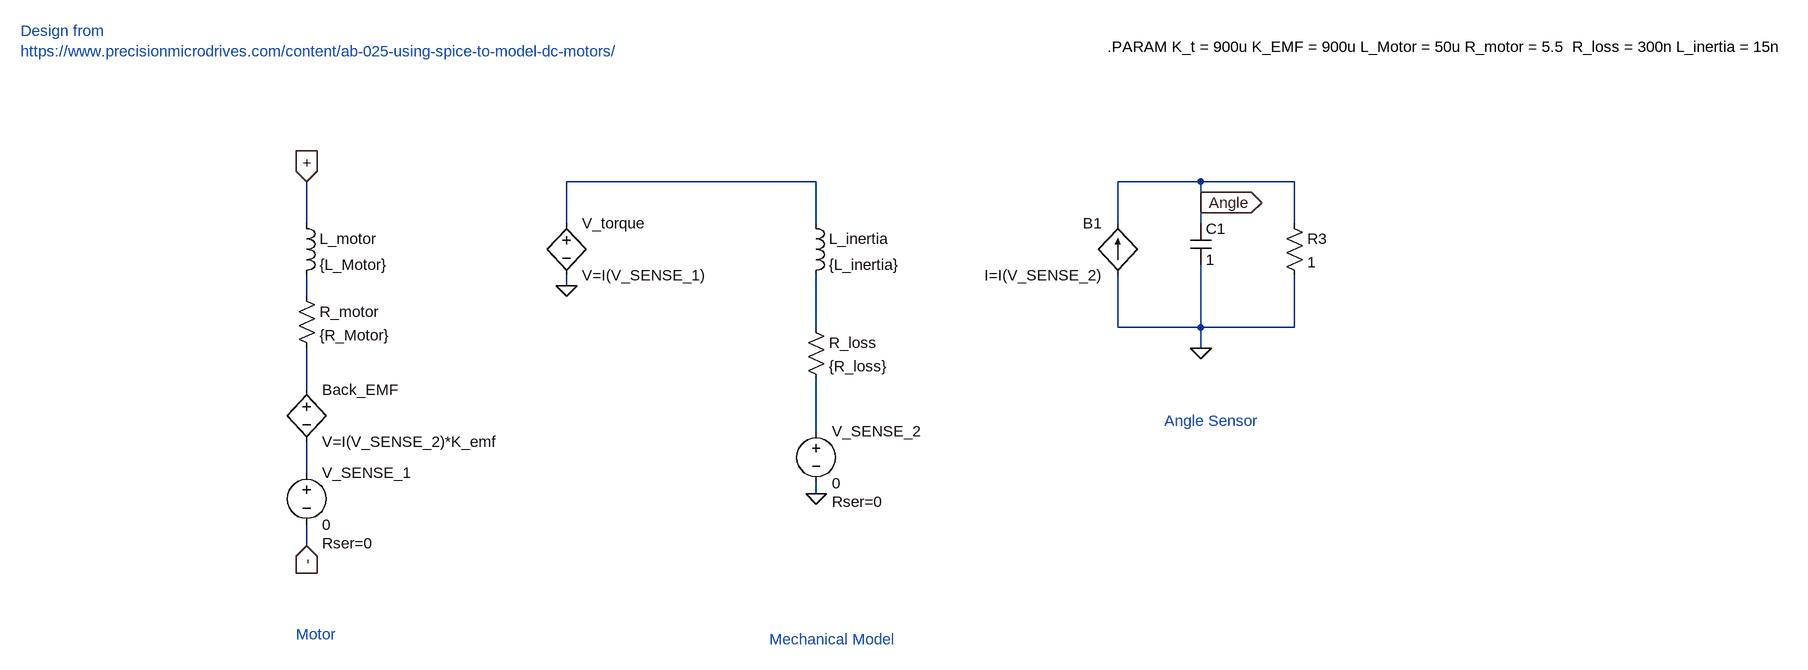
[diagram p0: schematic Servo.asc]
Servo.asc, the LTspice schematic file:
Version 4
SHEET 1 2604 808
WIRE 1024 64 640 64
WIRE 1616 64 1488 64
WIRE 1760 64 1616 64
WIRE 1616 96 1616 64
WIRE 240 128 240 64
WIRE 640 128 640 64
WIRE 1024 128 1024 64
WIRE 1488 128 1488 64
WIRE 1616 128 1616 96
WIRE 1760 128 1760 64
WIRE 640 224 640 208
WIRE 240 240 240 208
WIRE 1024 288 1024 208
WIRE 1488 288 1488 208
WIRE 1616 288 1616 192
WIRE 1616 288 1488 288
WIRE 1760 288 1760 208
WIRE 1760 288 1616 288
WIRE 1616 320 1616 288
WIRE 240 384 240 320
WIRE 1024 448 1024 368
WIRE 240 512 240 464
WIRE 1024 544 1024 528
WIRE 240 624 240 592
FLAG 640 224 0
FLAG 1024 544 0
FLAG 1616 320 0
FLAG 240 64 +
IOPIN 240 64 In
FLAG 1616 96 Angle
IOPIN 1616 96 Out
FLAG 240 624 -
IOPIN 240 624 In
SYMBOL voltage 240 496 R0
WINDOW 123 0 0 Left 0
WINDOW 39 24 124 Left 2
SYMATTR SpiceLine Rser=0
SYMATTR InstName V_SENSE_1
SYMATTR Value 0
SYMBOL voltage 1024 432 R0
WINDOW 123 0 0 Left 0
WINDOW 39 24 124 Left 2
SYMATTR SpiceLine Rser=0
SYMATTR InstName V_SENSE_2
SYMATTR Value 0
SYMBOL ind 224 112 R0
SYMATTR InstName L_motor
SYMATTR Value {L_Motor}
SYMBOL res 224 224 R0
SYMATTR InstName R_motor
SYMATTR Value {R_Motor}
SYMBOL ind 1008 112 R0
SYMATTR InstName L_inertia
SYMATTR Value {L_inertia}
SYMATTR SpiceLine Rser=0 Rpar=0
SYMBOL res 1008 272 R0
SYMATTR InstName R_loss
SYMATTR Value {R_loss}
SYMBOL cap 1600 128 R0
SYMATTR InstName C1
SYMATTR Value 1
SYMBOL res 1744 112 R0
SYMATTR InstName R3
SYMATTR Value 1
SYMBOL bv 640 112 R0
SYMATTR InstName V_torque
SYMATTR Value V=I(V_SENSE_1)
SYMBOL bv 240 368 R0
SYMATTR InstName Back_EMF
SYMATTR Value V=I(V_SENSE_2)*K_emf
SYMBOL bi 1488 208 R180
WINDOW 0 24 80 Left 2
WINDOW 3 24 0 Left 2
SYMATTR InstName B1
SYMATTR Value I=I(V_SENSE_2)
TEXT -200 -168 Left 2 ;Design from\nhttps://www.precisionmicrodrives.com/content/ab-025-using-spice-to-model-dc-motors/
TEXT 1472 -144 Left 2 !.PARAM K_t = 900u K_EMF = 900u L_Motor = 50u R_motor = 5.5  R_loss = 300n L_inertia = 15n
TEXT 224 760 Left 2 ;Motor
TEXT 952 768 Left 2 ;Mechanical Model
TEXT 1560 432 Left 2 ;Angle Sensor

The netlist it stands for:
* Servo.asc
V_SENSE_1 N006 - 0 Rser=0
V_SENSE_2 N005 0 0 Rser=0
L_motor + N002 {L_Motor}
R_motor N002 N004 {R_Motor}
L_inertia N001 N003 {L_inertia} Rser=0 Rpar=0
R_loss N003 N005 {R_loss}
C1 Angle 0 1
R3 Angle 0 1
B§V_torque N001 0 V=I(V_SENSE_1)
Back_EMF N004 N006 V=I(V_SENSE_2)*K_emf
B1 0 Angle I=I(V_SENSE_2)
* Design from
* https://www.precisionmicrodrives.com/content/ab-025-using-spice-to-model-dc-motors/
.PARAM K_t = 900u K_EMF = 900u L_Motor = 50u R_motor = 5.5  R_loss = 300n L_inertia = 15n
* Motor
* Mechanical Model
* Angle Sensor
.backanno
.end